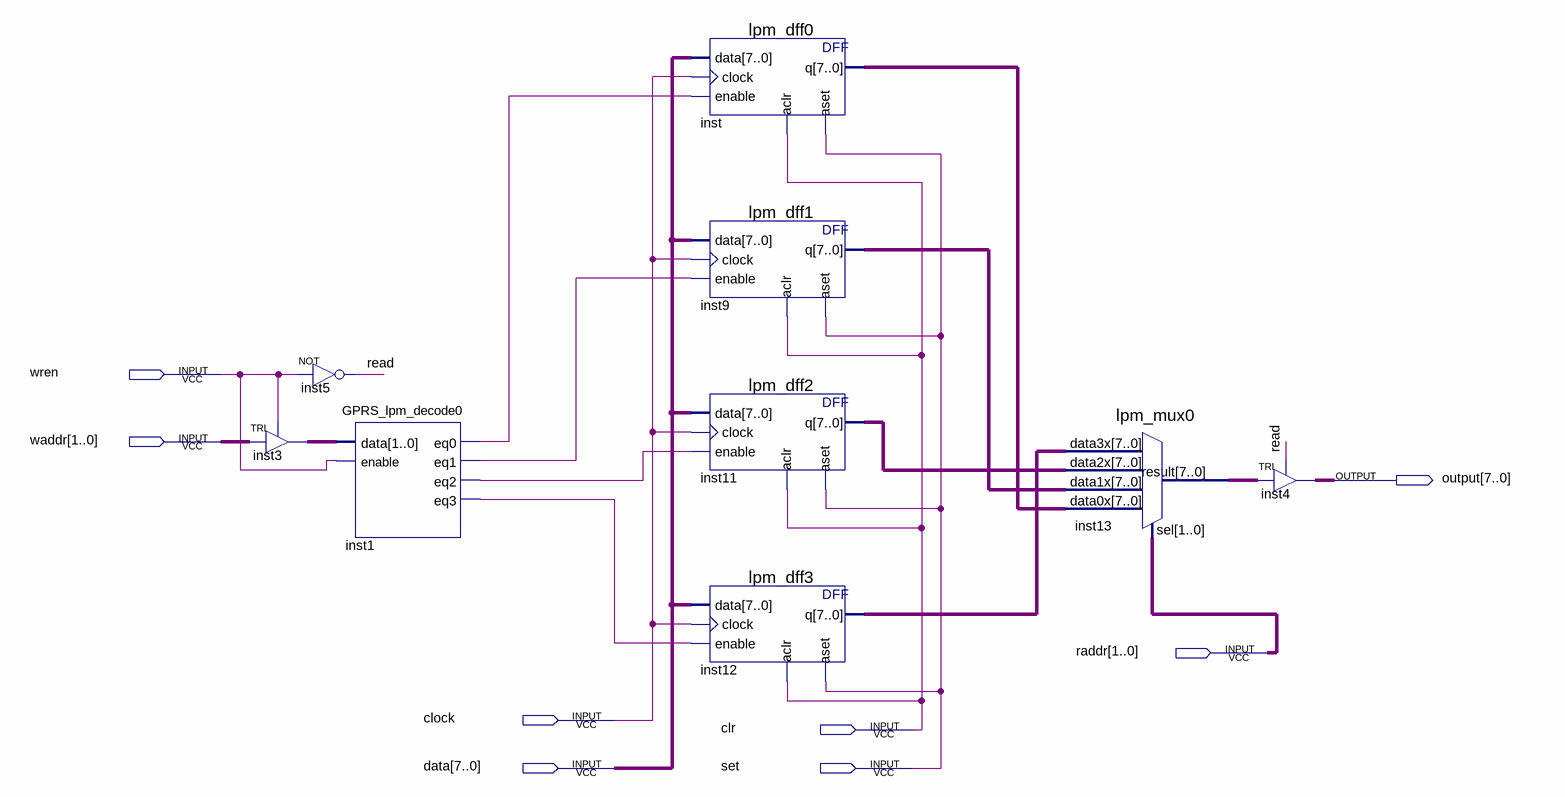
[diagram p0: schematic sheet]
// Quartus schematic Register.bdf as structural Verilog: 9 symbols, 8 pins
module Register (
  input  wren,
  input  [1:0] waddr,
  input  [1:0] raddr,
  input  clock,
  input  clr,
  input  [7:0] data,
  input  set,
  output [7:0] \output 
);

  wire inst1_eq0, inst1_eq1, inst1_eq2, inst1_eq3, read;
  wire [1:0] inst3_out;
  wire [7:0] inst9_q, inst11_q, inst12_q, inst13_result, inst_q;

  TRI inst3[1:0] (.IN(waddr), .OE(wren), .OUT(inst3_out));
  not inst5 (read, wren);
  GPRS_lpm_decode0 inst1 (
    .data(inst3_out), .enable(wren), .eq0(inst1_eq0), .eq1(inst1_eq1), .eq2(inst1_eq2), .eq3(inst1_eq3));
  lpm_dff0 inst (.data(data), .clock(clock), .enable(inst1_eq0), .aclr(clr), .aset(set), .q(inst_q));
  lpm_dff1 inst9 (.data(data), .clock(clock), .enable(inst1_eq1), .aclr(clr), .aset(set), .q(inst9_q));
  lpm_dff2 inst11 (.data(data), .clock(clock), .enable(inst1_eq2), .aclr(clr), .aset(set), .q(inst11_q));
  lpm_dff3 inst12 (.data(data), .clock(clock), .enable(inst1_eq3), .aclr(clr), .aset(set), .q(inst12_q));
  lpm_mux0 inst13 (
    .data3x(inst12_q), .data2x(inst11_q), .data1x(inst9_q), .data0x(inst_q), .sel(raddr),
    .result(inst13_result));
  TRI inst4[7:0] (.IN(inst13_result), .OE(read), .OUT(\output ));
endmodule
